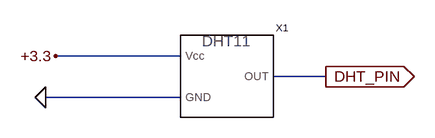
[diagram p0: schematic DHT11_sensor.asc]
DHT11_sensor.asc, the LTspice schematic file:
Version 4.1
SHEET 1 880 680
WIRE 96 144 -96 144
WIRE 320 176 240 176
WIRE 96 208 -112 208
FLAG -96 144 +3.3
FLAG -112 208 0
FLAG 320 176 DHT_PIN
IOPIN 320 176 Out
SYMBOL t_sensor. 96 112 R0
SYMATTR InstName X1

The netlist it stands for:
* DHT11_sensor.asc
X§X1 +3.3 0 DHT_PIN t_sensor.  ; pins Vcc GND OUT
.backanno
.end